# EAGLE design Accessory - Power v5 (EAGLE 5.06)
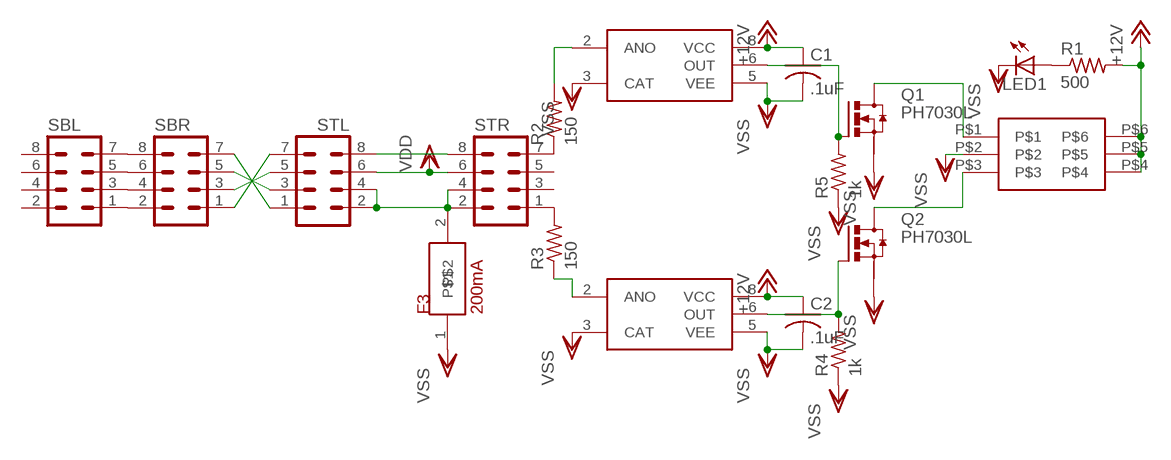
[diagram p0: schematic, sheet 1]

## Parts
C1  .1uF  C-USC0603  [C0603]
C2  .1uF  C-USC0603  [C0603]
F3  200mA  FUSE  [R0603]
LED1  LEDCHIP-LED0603  [CHIP-LED0603]
Q1  PH7030L  [SOT669]
Q2  PH7030L  [SOT669]
R1  500  R-US_R0603  [R0603]
R2  150  R-US_R0603  [R0603]
R3  150  R-US_R0603  [R0603]
R4  1k  R-US_R0603  [R0603]
R5  1k  R-US_R0603  [R0603]
SBL  MA04-2  [MA04-2]
SBR  MA04-2  [MA04-2]
STL  MA04-2  [MA04-2]
STR  MA04-2  [MA04-2]
U$1  0015246060  [015246040]
U$2  FOD3181  [DIL08]
U$3  FOD3181  [DIL08]

## Nets
+12V: C1.1 C2.1 R1.2 U$1.P$4 U$1.P$5 U$1.P$6 U$2.8(VCC) U$3.8(VCC)
N$2: R2.2 U$3.2(ANO)
N$3: R3.1 U$2.2(ANO)
N$4: R3.2 STR.1
N$5: R2.1 STR.7
N$8: SBR.7 STL.1
N$9: SBR.5 STL.3
N$10: SBR.3 STL.5
N$11: SBR.1 STL.7
N$12: SBL.1 SBR.2
N$13: SBL.3 SBR.4
N$14: SBL.5 SBR.6
N$15: SBL.7 SBR.8
N$20: STL.8 STR.8
N$21: F3.2 STL.2 STL.4 STR.2 STR.4
N$22: Q2.MB(D) U$1.P$3
N$23: Q1.MB(D) U$1.P$1
N$29: LED1.A R1.1
N$32: Q1.4(G) R5.2 U$3.6(OUT)
N$33: Q2.4(G) R4.2 U$2.6(OUT)
VDD: STL.6 STR.6
VSS: C1.2 C2.2 F3.1 LED1.C Q1.1(S) Q2.1(S) R4.1 R5.1 U$1.P$2 U$2.3(CAT) U$2.5(VEE) U$3.3(CAT) U$3.5(VEE)
Unconnected: Q1.2(S) Q1.3(S) Q2.2(S) Q2.3(S) SBL.2 SBL.4 SBL.6 SBL.8 STR.3 STR.5

## Library data of the parts
C1 C2 = rcl:C-US: CAPACITOR, American symbol
F3 = rcl:FUSE
LED1 = led:LED: LED OSRAM: - CHIPLED LG R971, LG N971, LY N971, LG Q971, LY Q971, LO R971, LY R971 LH N974, LH R974 LS Q976, LO Q976, LY Q976 LO Q996 - Hyper CHIPLED LW Q18S LB Q993, LB Q99A, LB R99A - SideLED LS A670, LO A670, LY A670, LG A670, LP A670 LB A673, LV A673, LT A673, LW A673 LH A674 LY A675 LS A676, LA A676, LO A676, LY A676, LW A676 LS A679, LY A679, LG A679 - Hyper Micro SIDELED® LS Y876, LA Y876, LO Y876, LY Y876 LT Y87S - SmartLED LW L88C, LW L88S LB L89C, LB L89S, LG L890 LS L89K, LO L89K, LY L89K LS L896, LA L896, LO L896, LY L896 - TOPLED LS T670, LO T670, LY T670, LG T670, LP T670 LSG T670, LSP T670, LSY T670, LOP T670, LYG T670 LG T671, LOG T671, LSG T671 LB T673, LV T673, LT T673, LW T673 LH T674 LS T676, LA T676, LO T676, LY T676, LB T676, LH T676, LSB T676, LW T676 LB T67C, LV T67C, LT T67C, LS T67K, LO T67K, LY T67K, LW E67C LS E67B, LA E67B, LO E67B, LY E67B, LB E67C, LV E67C, LT E67C LW T67C LS T679, LY T679, LG T679 LS T770, LO T770, LY T770, LG T770, LP T770 LB T773, LV T773, LT T773, LW T773 LH T774 LS E675, LA E675, LY E675, LS T675 LS T776, LA T776, LO T776, LY T776, LB T776 LHGB T686 LT T68C, LB T68C - Hyper Mini TOPLED® LB M676 - Mini TOPLED Santana® LG M470 LS M47K, LO M47K, LY M47K Source: http://www.osram.convergy.de LUXEON: - LUMILED® LXK2-PW12-R00, LXK2-PW12-S00, LXK2-PW14-U00, LXK2-PW14-V00 LXK2-PM12-R00, LXK2-PM12-S00, LXK2-PM14-U00 LXK2-PE12-Q00, LXK2-PE12-R00, LXK2-PE12-S00, LXK2-PE14-T00, LXK2-PE14-U00 LXK2-PB12-K00, LXK2-PB12-L00, LXK2-PB12-M00, LXK2-PB14-N00, LXK2-PB14-P00, LXK2-PB14-Q00 LXK2-PR12-L00, LXK2-PR12-M00, LXK2-PR14-Q00, LXK2-PR14-R00 LXK2-PD12-Q00, LXK2-PD12-R00, LXK2-PD12-S00 LXK2-PH12-R00, LXK2-PH12-S00 LXK2-PL12-P00, LXK2-PL12-Q00, LXK2-PL12-R00 Source: www.luxeon.com KINGBRIGHT: KA-3528ASYC Source: www.kingbright.com
Q1 Q2 = transistor-power:PH7030L: N-channel TrenchMOS (TM) logic level FET Source: http://www.nxp.com/acrobat_download/datasheets/PH7030L_4.pdf
R1-R5 = rcl:R-US_: RESISTOR, American symbol
SBL SBR STL STR = con-lstb:MA04-2: PIN HEADER
U$1 = Power Headers:0015246060
U$2 U$3 = ref-packages:FOD3181

## Board
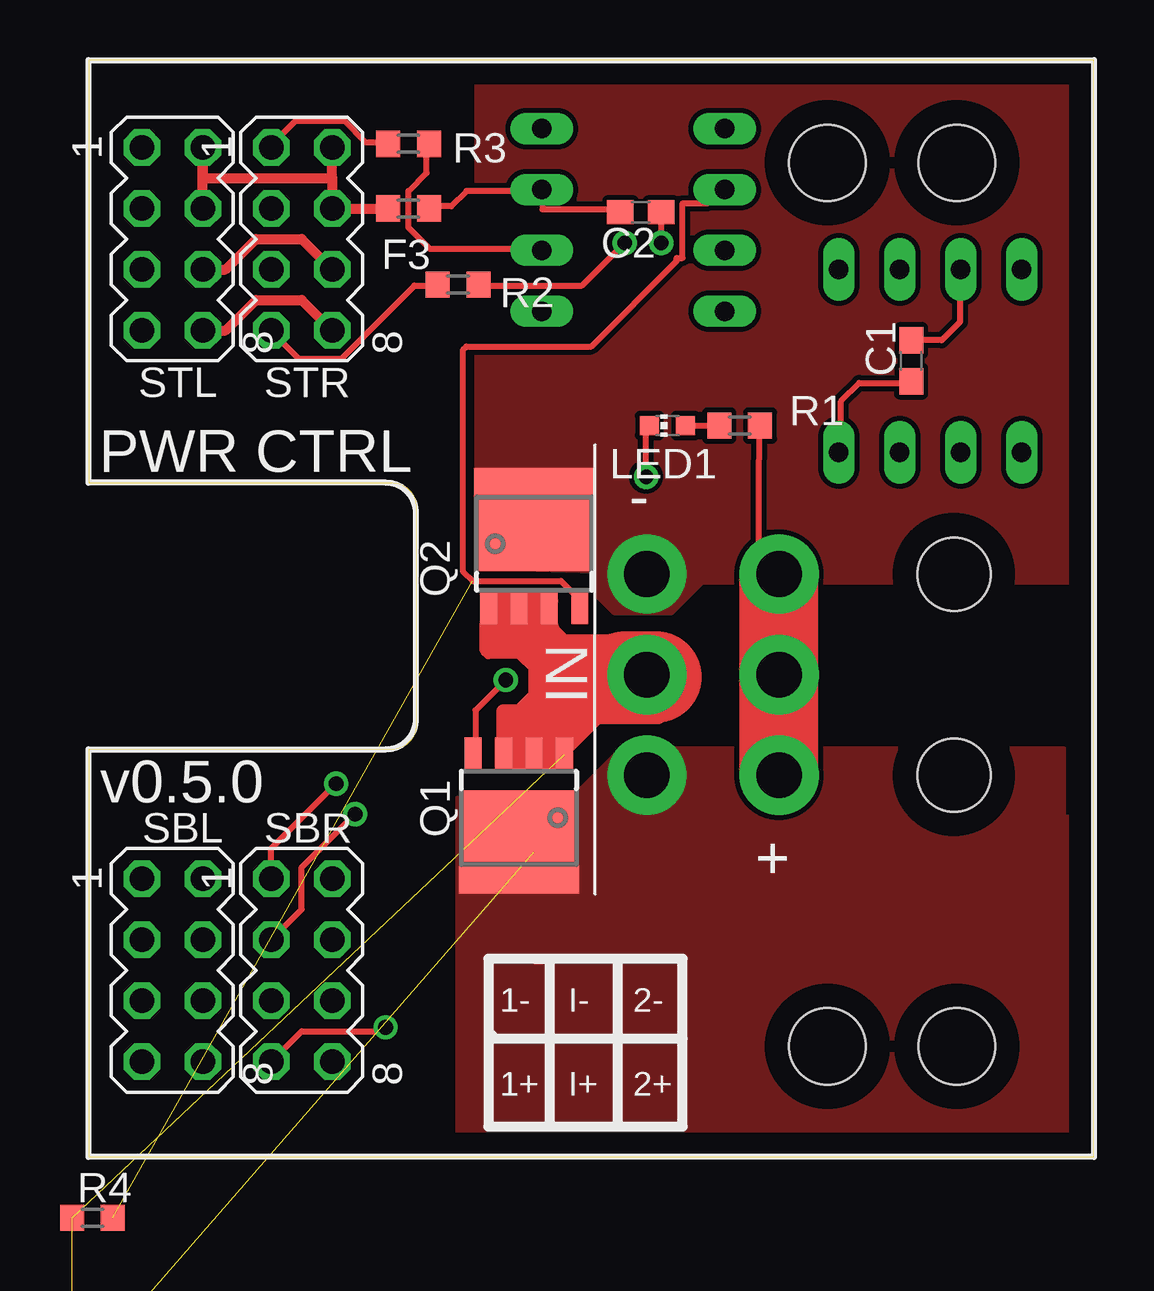
[diagram p1: board, top side]
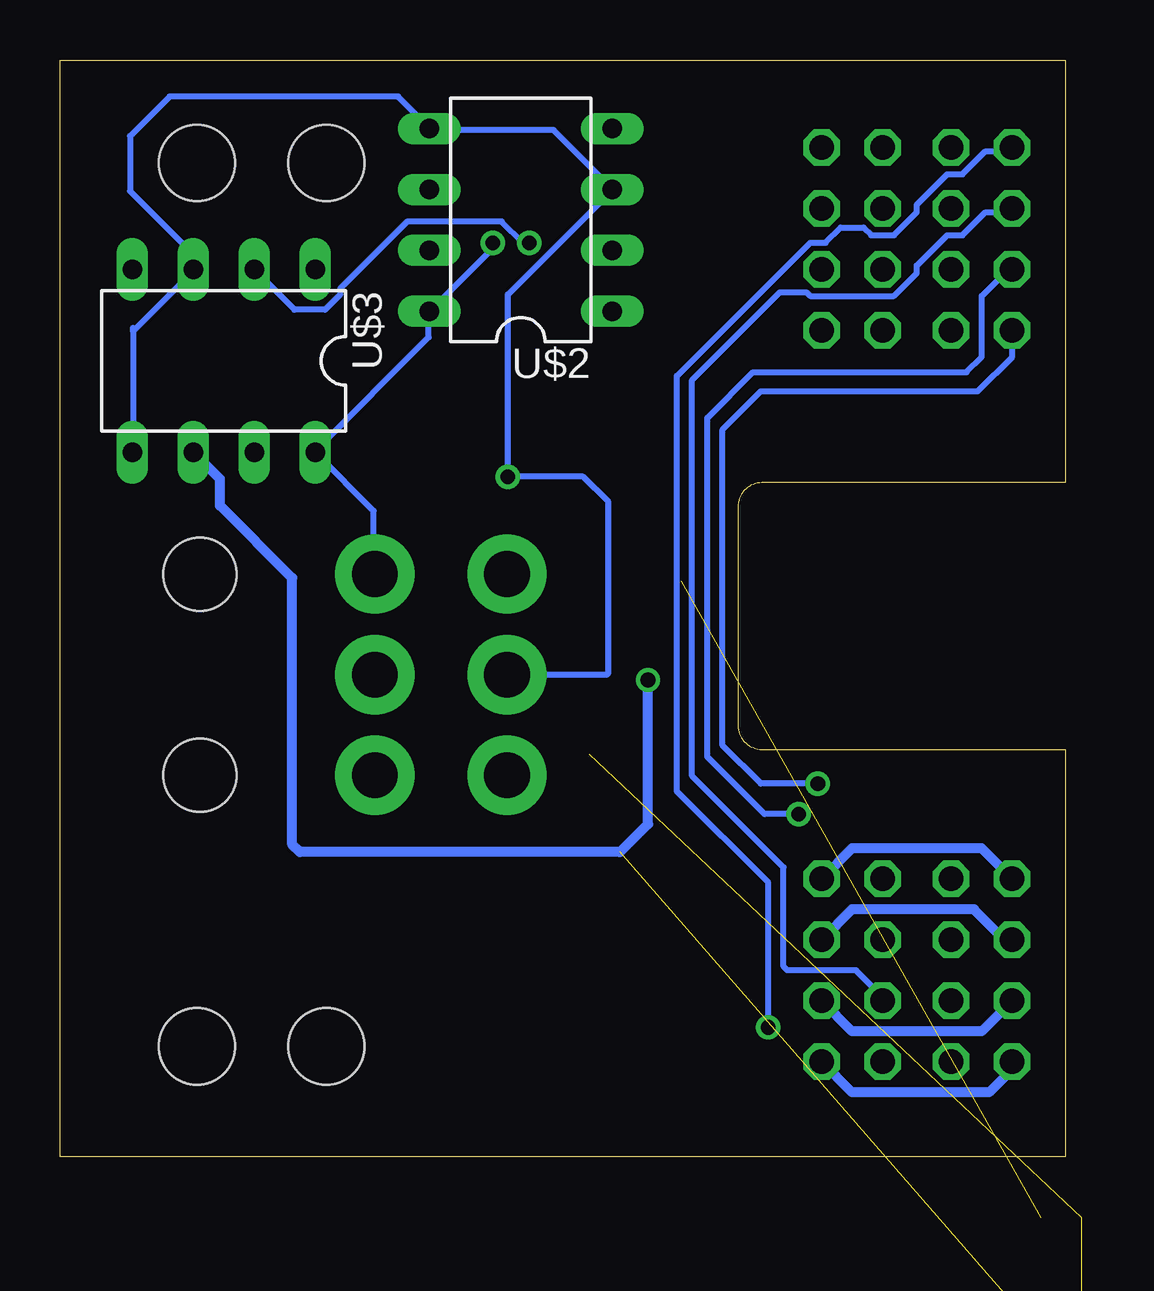
[diagram p2: board, bottom side, seen from below]

Size 41.91 x 45.72 mm. Coordinates in mm from the lower left corner, seen from the top.
Outline: 0,16.99 0,0 41.91,0 41.91,45.72 0,45.72 0,28.1 12.65,28.1 arc-90 13.65,27.1 13.65,17.99 arc-90 12.65,16.99 0,16.99
Copper layers (1*16): Top 0.035mm / dielectric 1.5mm / Bottom 0.035mm
Design rules "default *": minimum track width 10mil, minimum drill 24mil, track to track 8mil, track to pad 8mil, pad to pad 8mil, via to via 8mil, smd to smd 8mil, copper to edge 40mil, drill to drill 8mil, minimum pad ring 10mil, minimum via ring 8mil, stop-mask expansion 4mil, vias tented up to drill 0mil, thermal gap 0mil
Holes 3.17 mm at 36.2,41.43 36.2,4.6 30.8,41.43 30.8,4.6

### Footprints (pad centres in the part's own frame; a part is rotated, then mirrored left to right if it is on the bottom)
C0603 = smd 1.1 x 1: 1 -0.85,0; 2 0.85,0
R0603 = smd 1 x 1.1: 1 -0.85,0; 2 0.85,0
CHIP-LED0603 = smd 0.8 x 0.8: A 0,-0.75; C 0,0.75
SOT669 = smd 0.7 x 1.4: 1 -1.905,-2.65; 2 -0.635,-2.65; 3 0.635,-2.65; 4 1.905,-2.65 | smd 5 x 4.3: MB 0,1
MA04-2 = drill 1.016 octagon: 1 -3.81,-1.27; 2 -3.81,1.27; 3 -1.27,-1.27; 4 -1.27,1.27; 5 1.27,-1.27; 6 1.27,1.27; 7 3.81,-1.27; 8 3.81,1.27
015246040 = drill 1.905 pad 3.302 round: P$1 -8.382,4.191; P$2 -4.191,4.191; P$3 0,4.191; P$4 0,-1.321; P$5 -4.191,-1.321; P$6 -8.382,-1.321 | hole 3.048: -8.382,-8.611; 0,-8.611
DIL08 = drill 0.813 long: 1 -3.81,-3.81; 2 -1.27,-3.81; 3 1.27,-3.81; 4 3.81,-3.81; 5 3.81,3.81; 6 1.27,3.81; 7 -1.27,3.81; 8 -3.81,3.81

### Placement (x,y rotation side)
C1  34.29,33.18 90 top
C2  23.02,39.37 180 top
F3  13.34,39.53 180 top
LED1  24.13,30.48 90 top
Q1  17.94,14.13 180 top
Q2  18.57,25.56 0 top
R1  27.15,30.48 0 top
R2  15.4,36.35 0 top
R3  13.34,42.23 180 top
R4  0.16,-2.54 0 top
R5  0.16,-7.46 0 top  (outside the outline)
SBL  3.49,7.78 270 top
SBR  8.89,7.78 270 top
STL  3.49,38.26 270 top
STR  8.89,38.26 270 top
U$1  27.46,24.29 90 top
U$2  22.7,39.05 90 bottom
U$3  35.08,33.18 180 bottom

### Tracks (layer width: path | path; a pad name or v marks a point on that pad's centre or on a via)
+12V  (via drill 0.61)
  Top 0.254: v23.88,38.1 C2.1 | R1.2 27.94,28.57 27.94,25.65 U$1.P$4 | C1.1 34.29,32.26 32.13,32.26 31.37,31.5 31.37,29.46 U$3.8
  Top 3.302: U$1.P$4 U$1.P$5 U$1.P$6
  Bottom 0.254: v23.88,38.1 23.88,37.85 26.42,35.31 U$2.8 26.54,35.18 26.54,34.16 31.24,29.46 U$3.8 31.24,29.34 28.83,26.92 28.83,24.38 U$1.P$4
N$2  (via drill 0.61)
  Top 0.254: v22.35,38.1 20.57,36.32 16.26,36.32 R2.2
  Bottom 0.254: v22.35,38.1 22.61,38.1 23.5,38.99 27.43,38.99 30.23,36.2 30.23,35.94 30.86,35.31 32.13,35.31 33.78,36.96 U$3.2
N$3
  Top 0.254: R3.1 14.1,42.16 14.1,41.02 13.34,40.26 13.34,38.73 14.22,37.85 18.8,37.85 U$2.2
N$4
  Top 0.254: R3.2 12.45,42.29 11.56,42.29 10.67,43.18 8.64,43.18 7.62,42.16 STR.1
N$5
  Top 0.254: R2.1 14.48,36.32 13.59,36.32 10.54,33.27 8.76,33.27 7.62,34.42 STR.7
N$8  (via drill 0.61)
  Top 0.254: v12.38,5.4 12.22,5.24 8.89,5.24 SBR.7 | SBR.7
  Bottom 0.254: STL.1 2.22,41.91 3.33,41.91 4.29,40.96 4.92,40.96 6.19,39.69 6.19,39.37 7.14,38.42 8.1,38.42 8.41,38.73 9.37,38.73 10,38.1 10.64,38.1 16.19,32.54 16.19,15.24 12.38,11.43 v12.38,5.4 | SBR.7
N$9
  Bottom 0.254: STL.3 2.22,39.37 3.33,39.37 4.29,38.42 4.92,38.42 6.19,37.15 6.19,36.83 7.14,35.88 10.64,35.88 10.79,36.04 11.91,36.04 15.56,32.38 15.56,15.88 11.75,12.06 11.75,7.94 11.59,7.78 8.73,7.78 7.62,6.67 SBR.5 7.62,6.6
N$10  (via drill 0.61)
  Top 0.254: v11.11,14.29 8.89,12.06 8.89,10.32 SBR.3 | SBR.3
  Bottom 0.254: STL.5 2.38,36.99 3.49,35.88 3.49,33.34 4.13,32.7 13.02,32.7 14.92,30.8 14.92,16.67 12.54,14.29 v11.11,14.29
N$11  (via drill 0.61)
  Top 0.254: v10.32,15.56 7.62,12.86 SBR.1
  Bottom 0.254: STL.7 2.22,33.34 3.65,31.91 12.7,31.91 14.29,30.32 14.29,17.14 12.7,15.56 v10.32,15.56
N$12
  Bottom 0.406: SBL.1 3.49,12.86 8.89,12.86 SBR.2
N$13
  Bottom 0.406: SBL.3 2.54,9.05 3.81,10.32 8.89,10.32 SBR.4
N$14
  Bottom 0.406: SBL.5 3.49,5.24 8.89,5.24 SBR.6
N$15
  Bottom 0.406: SBL.7 2.22,3.65 3.17,2.7 8.89,2.7 SBR.8
N$20
  Top 0.406: STL.8 5.71,34.45 6.99,35.72 8.89,35.72 STR.8 10.16,34.77
N$21
  Top 0.406: STL.4 STL.2 4.76,40.8 10.16,40.8 | 10.16,40.8 STR.4 F3.2 | 10.16,40.8 STR.2
N$22
  pour Top (no thermals): 21.11,24.45 21.11,23.5 21.91,22.7 24.29,22.7 25.56,23.97 41.91,23.97 41.91,45.4 16.19,45.4 16.19,24.61
N$23
  pour Top (no thermals): 15.4,14.92 15.4,0.32 41.43,0 41.43,14.13 40.64,14.13 40.64,16.99 22.22,16.99 20.32,15.08
N$25
  Top 0.61: 20.48,18.26 20.8,18.57
N$26
  Top 0.813: 18.1,21.11 18.73,20.48 18.73,19.68 | 18.73,19.68 18.73,19.37 | 18.73,19.68 18.73,19.21 17.94,18.41
N$27
  Top 3.81: 23.02,20 22.7,20 | 22.38,20 23.02,20 | 23.02,20 23.65,20
N$28
  Top 0.61: 16.99,22.07 16.99,22.7
N$29
  Top 0.254: R1.1 | LED1.A R1.1
N$30
  Top 0.406: 21.75,18.41 arc-90 22.07,18.57 22.38,18.57 22.23,18.41 22.07,18.41 | 21.75,18.41 21.27,18.26 23.81,18.26 | 21.75,21.43 22.07,21.59 23.97,21.59 | 23.97,21.59 24.13,21.59 24.61,20.64 24.45,20.8 23.97,21.59 | 23.97,21.59 23.65,21.43 | 21.43,18.57 21.75,18.41 | 21.75,18.41 22.07,18.41 | 22.07,18.41 23.97,18.41 24.61,18.89 | 18.89,20.48 18.89,20.64 | 18.89,19.21 18.89,20.48 | 18.89,18.89 18.89,19.21 | 18.89,19.21 18.41,18.73 | 18.89,20.48 | 18.89,20.48 18.41,20.95 | 18.41,20.95 18.1,21.27 | 18.41,20.95 18.57,20.95 | 18.41,20.95 16.67,20.95 16.51,21.11 16.51,22.23
  Top 0.61: 23.65,19.84 22.07,19.84 22.38,19.53 23.65,19.53 23.97,19.84 24.61,20.16 22.07,20.16 21.75,19.84 | 21.75,19.84 21.75,20.16 22.07,20.48 23.97,20.48 24.61,19.84 24.29,19.84 23.65,19.21 22.38,19.21 21.75,19.84 | 21.75,19.84 21.75,19.21 22.07,18.89 23.97,18.89 24.92,19.84 24.77,20.16 24.29,20.8 21.75,20.8 | 21.75,21.11 21.43,21.11 21.43,21.43 21.75,21.43 22.7,21.43 22.7,21.11 | 21.75,21.11 24.61,21.11 24.92,20.48 24.92,19.68 24.61,18.89 24.29,18.57 21.75,18.57 21.43,18.89 21.43,19.53 | 19.84,21.43 20.16,21.11 | 19.53,21.43 19.84,21.43 | 19.21,17.62 19.21,17.3 | 19.21,17.62 18.26,17.62 | 19.21,17.62 19.21,17.94 17.94,17.94 17.94,16.99 19.53,16.99 19.53,18.26 17.62,18.26 17.62,16.67 19.84,16.67 19.84,16.99 | 19.84,21.43 20.48,21.43 20.48,21.11 20.8,20.8 20.8,21.43 21.11,21.43 | 22.7,21.11 21.75,21.11 | 22.7,21.11 22.7,20.8 21.75,20.8 | 22.7,21.11 23.02,21.11 | 20.48,19.21 20.16,18.89 arc-135 19.98,19.34 20.48,19.84 | 20.48,19.21 20.8,19.53 | 16.67,23.02 16.67,21.75 18.89,21.75 | 21.75,20.8 21.43,20.48 21.43,19.53 | 21.75,20.8 21.11,20.8 21.11,21.43 | 20.48,20.16 19.53,21.11 | 19.53,21.11 18.89,21.75 | 18.89,21.75 19.21,21.75 | 21.43,18.57 20.8,17.94 20.16,17.94 19.84,17.62 19.84,16.99 | 20.8,18.89 20.16,18.26 | 20.8,18.89 19.84,18.89 | 20.8,18.89 21.43,19.53 | 21.11,19.84 21.11,21.43 | 21.11,19.84 20.48,20.48 | 20.48,20.48 19.53,21.43 | 19.53,21.43 19.21,21.75 | 20.48,19.84 21.11,19.84 | 21.11,19.84 21.11,18.89 | 21.11,18.89 20.8,18.89 | 21.11,18.89 21.11,18.26 19.84,16.99 | 19.84,16.99 19.84,18.57 18.89,18.57 | 18.57,18.57 18.89,18.57 | 18.57,18.57 arc193 18.89,21.43 | 18.57,18.57 17.3,18.57 17.3,16.35 19.84,16.35
  Top 0.61: 19.21,22.07 19.21,21.75 | 19.21,22.38 19.21,23.34 18.89,23.34 | 19.21,22.38 19.21,22.07 | 18.89,23.34 16.67,23.34 16.67,21.43 17.62,21.43 | 17.94,21.43 17.62,21.43 | 18.89,21.43 18.26,21.43 | 18.26,21.43 17.94,21.43 | 18.89,21.43 18.89,22.07 | 18.89,22.07 18.89,23.34 | 18.89,23.34 16.99,23.34 16.99,23.02 17.3,23.02 17.3,22.07 18.89,22.07 | 18.89,22.07 18.26,22.07 18.26,23.02 18.57,23.02 18.57,22.38 17.94,22.38 17.94,23.02 | 19.21,22.07 19.84,21.43 | 20.48,19.84 20.48,19.21 | 19.53,20.8 20.48,19.84 | 18.89,21.43 19.53,20.8 | 20.48,20.16 20.48,20.48 | 18.89,18.57 19.84,19.53 | 19.84,19.53 20.48,20.16 | 19.53,20.8 17.94,21.43 | 19.53,21.11 19.53,18.89 19.21,18.89 19.21,19.21 | 19.21,19.21 19.21,20.48 18.57,21.11 | 18.26,21.43 18.57,21.11 | 18.57,18.57 18.89,18.89 19.21,19.21 | 18.57,21.11 17.62,21.43 | 19.84,19.53 19.84,20.16 | 19.53,21.43 19.21,22.38
N$31
  Top 0.406: 21.75,21.59 19.84,21.59 19.37,22.07 19.37,23.18
N$32  (via drill 0.61)  (1 unrouted)
  Top 0.254: Q1.4 16.13,16.89 16.13,18.61 v17.4,19.88
  Bottom 0.406: U$3.6 35.24,28.26 35.24,27.15 32.23,24.13 32.23,13.02 31.91,12.7 18.57,12.7 17.4,13.88 v17.4,19.88
N$33  (1 unrouted)
  Top 0.254: Q2.4 20.45,22.99 20.45,23.24 19.68,24 16,24 15.62,24.38 15.62,33.66 15.75,33.78 20.95,33.78 24.51,37.34 24.51,37.47 24.77,37.47 24.77,39.75 25.78,39.75 26.42,40.39 U$2.6
VDD
  Top 0.406: STL.6 5.71,36.99 6.99,38.26 8.89,38.26 STR.6
VSS  (via drill 0.61)  (2 unrouted)
  Top 0.254: Q2.1 19.21,22.91 19.21,21.43 23.59,21.43 U$1.P$2 23.53,20.16 22.38,20.16 19.84,17.62 Q1.1 | F3.1 14.22,39.62 15.11,39.62 15.75,40.26 18.8,40.26 U$2.3 18.92,40.26 18.92,39.5 22.1,39.5 C2.2 | C1.2 34.42,34.04 35.56,34.04 36.32,34.8 36.32,36.96 U$3.3 | LED1.C 23.24,30.34 v23.24,28.35
  Bottom 0.254: 23.34,20.19 U$1.P$2 19.11,20.1 19.05,20.16 19.05,27.3 20.1,28.35 v23.24,28.35 23.24,35.94 18.92,40.26 U$2.3 18.92,40.39 21.34,42.8 26.42,42.8 U$2.5 26.54,42.93 27.81,44.2 37.34,44.2 38.99,42.55 38.99,40.26 36.45,37.72 36.45,37.08 U$3.3 | 38.86,34.42 38.86,29.46 U$3.5 | 38.86,34.42 38.86,34.54 | U$3.3 36.45,36.96 | 38.86,34.42 36.45,36.83 U$3.3

### Text on the board
tNames: PWR CTRL | - | IN | v0.5.0 | + | 1- | I- | 2- | 1+ | I+ | 2+